# Altium schematic sheet READ_2.SchDoc: FMC-320U
size A4; Author: DHS; SheetNumber: 1; SheetTotal: 7; thisVersion: 1; ThisRevision: 1; Release: 1
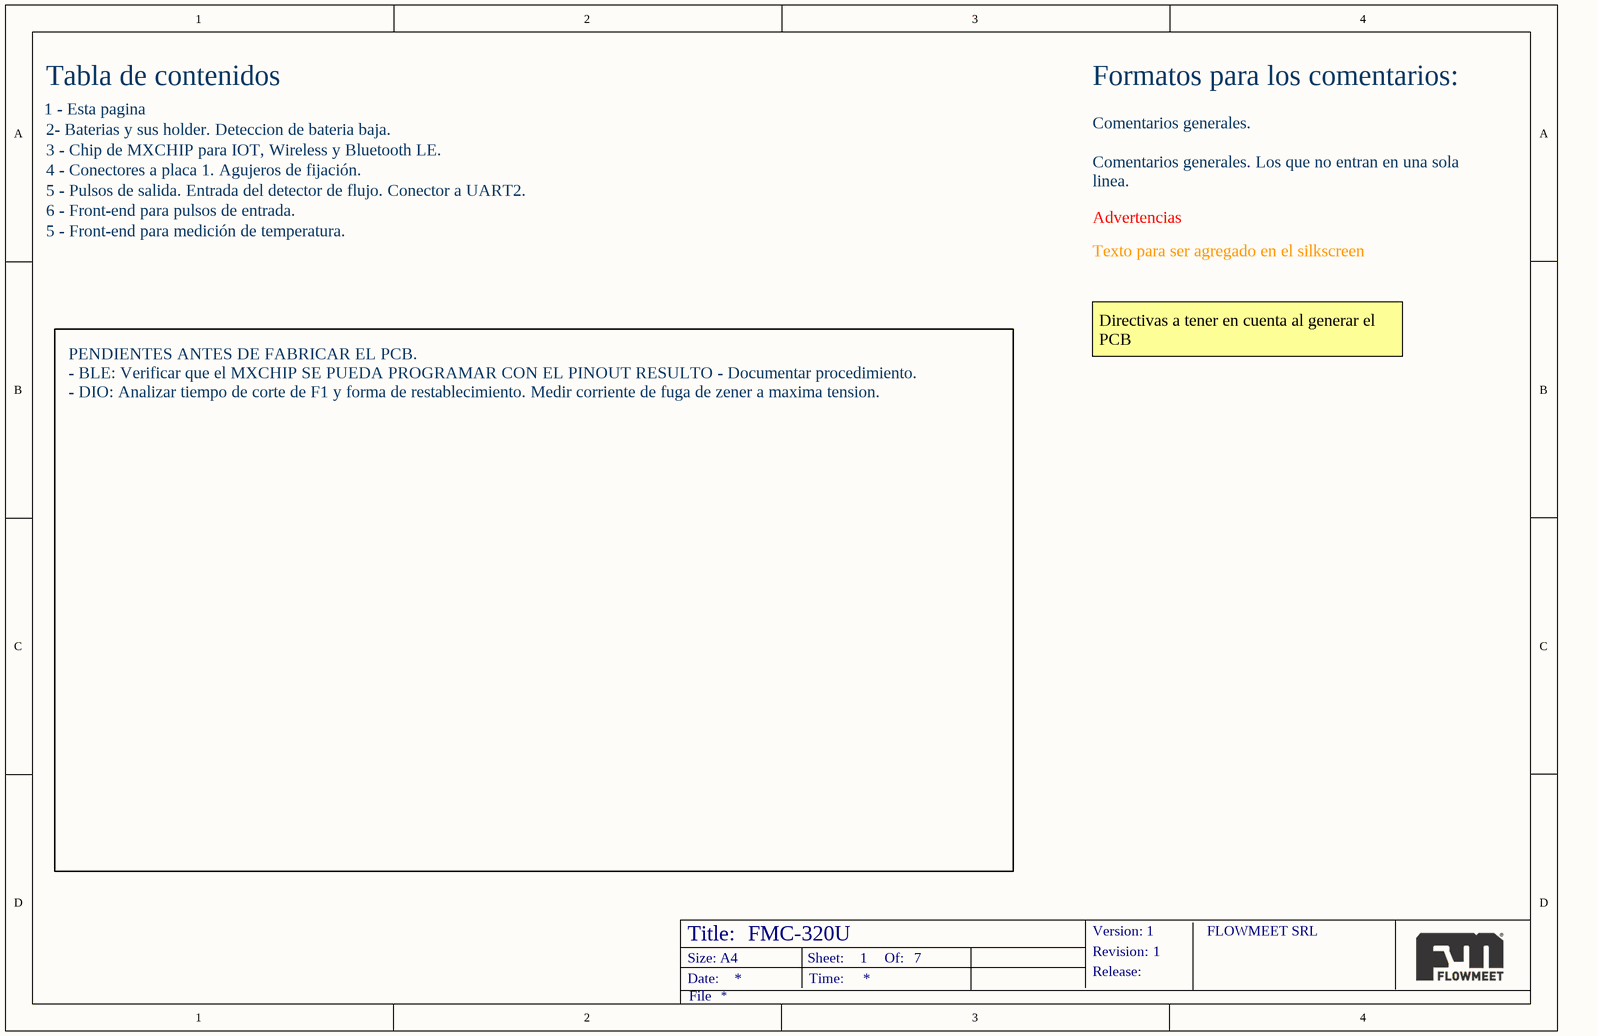
[diagram p0: READ_2.SchDoc]

## Notes on the sheet
- 1 - Esta pagina
- Tabla de contenidos
- Formatos para los comentarios:
- 2- Baterias y sus holder. Deteccion de bateria baja.
- 3 - Chip de MXCHIP para IOT, Wireless y Bluetooth LE.
- 4 - Conectores a placa 1. Agujeros de fijación.
- Comentarios generales.
- 5 - Pulsos de salida. Entrada del detector de flujo. Conector a UART2.
- 6 - Front-end para pulsos de entrada.
- 5 - Front-end para medición de temperatura.
- Advertencias
- Comentarios generales. Los que no entran en una sola linea.
- Texto para ser agregado en el silkscreen
- Directivas a tener en cuenta al generar el PCB
- PENDIENTES ANTES DE FABRICAR EL PCB.
  - BLE: Verificar que el MXCHIP SE PUEDA PROGRAMAR CON EL PINOUT RESULTO - Documentar procedimiento.
  - DIO: Analizar tiempo de corte de F1 y forma de restablecimiento. Medir corriente de fuga de zener a maxima tension.
- Title:
- Size: A4
- Date:
- Sheet:
- Time:
- Of:
- Version:
- Revision:
- Release:
- FLOWMEET SRL
- File